# Altium project PCB_Project_bkres.PrjPcb
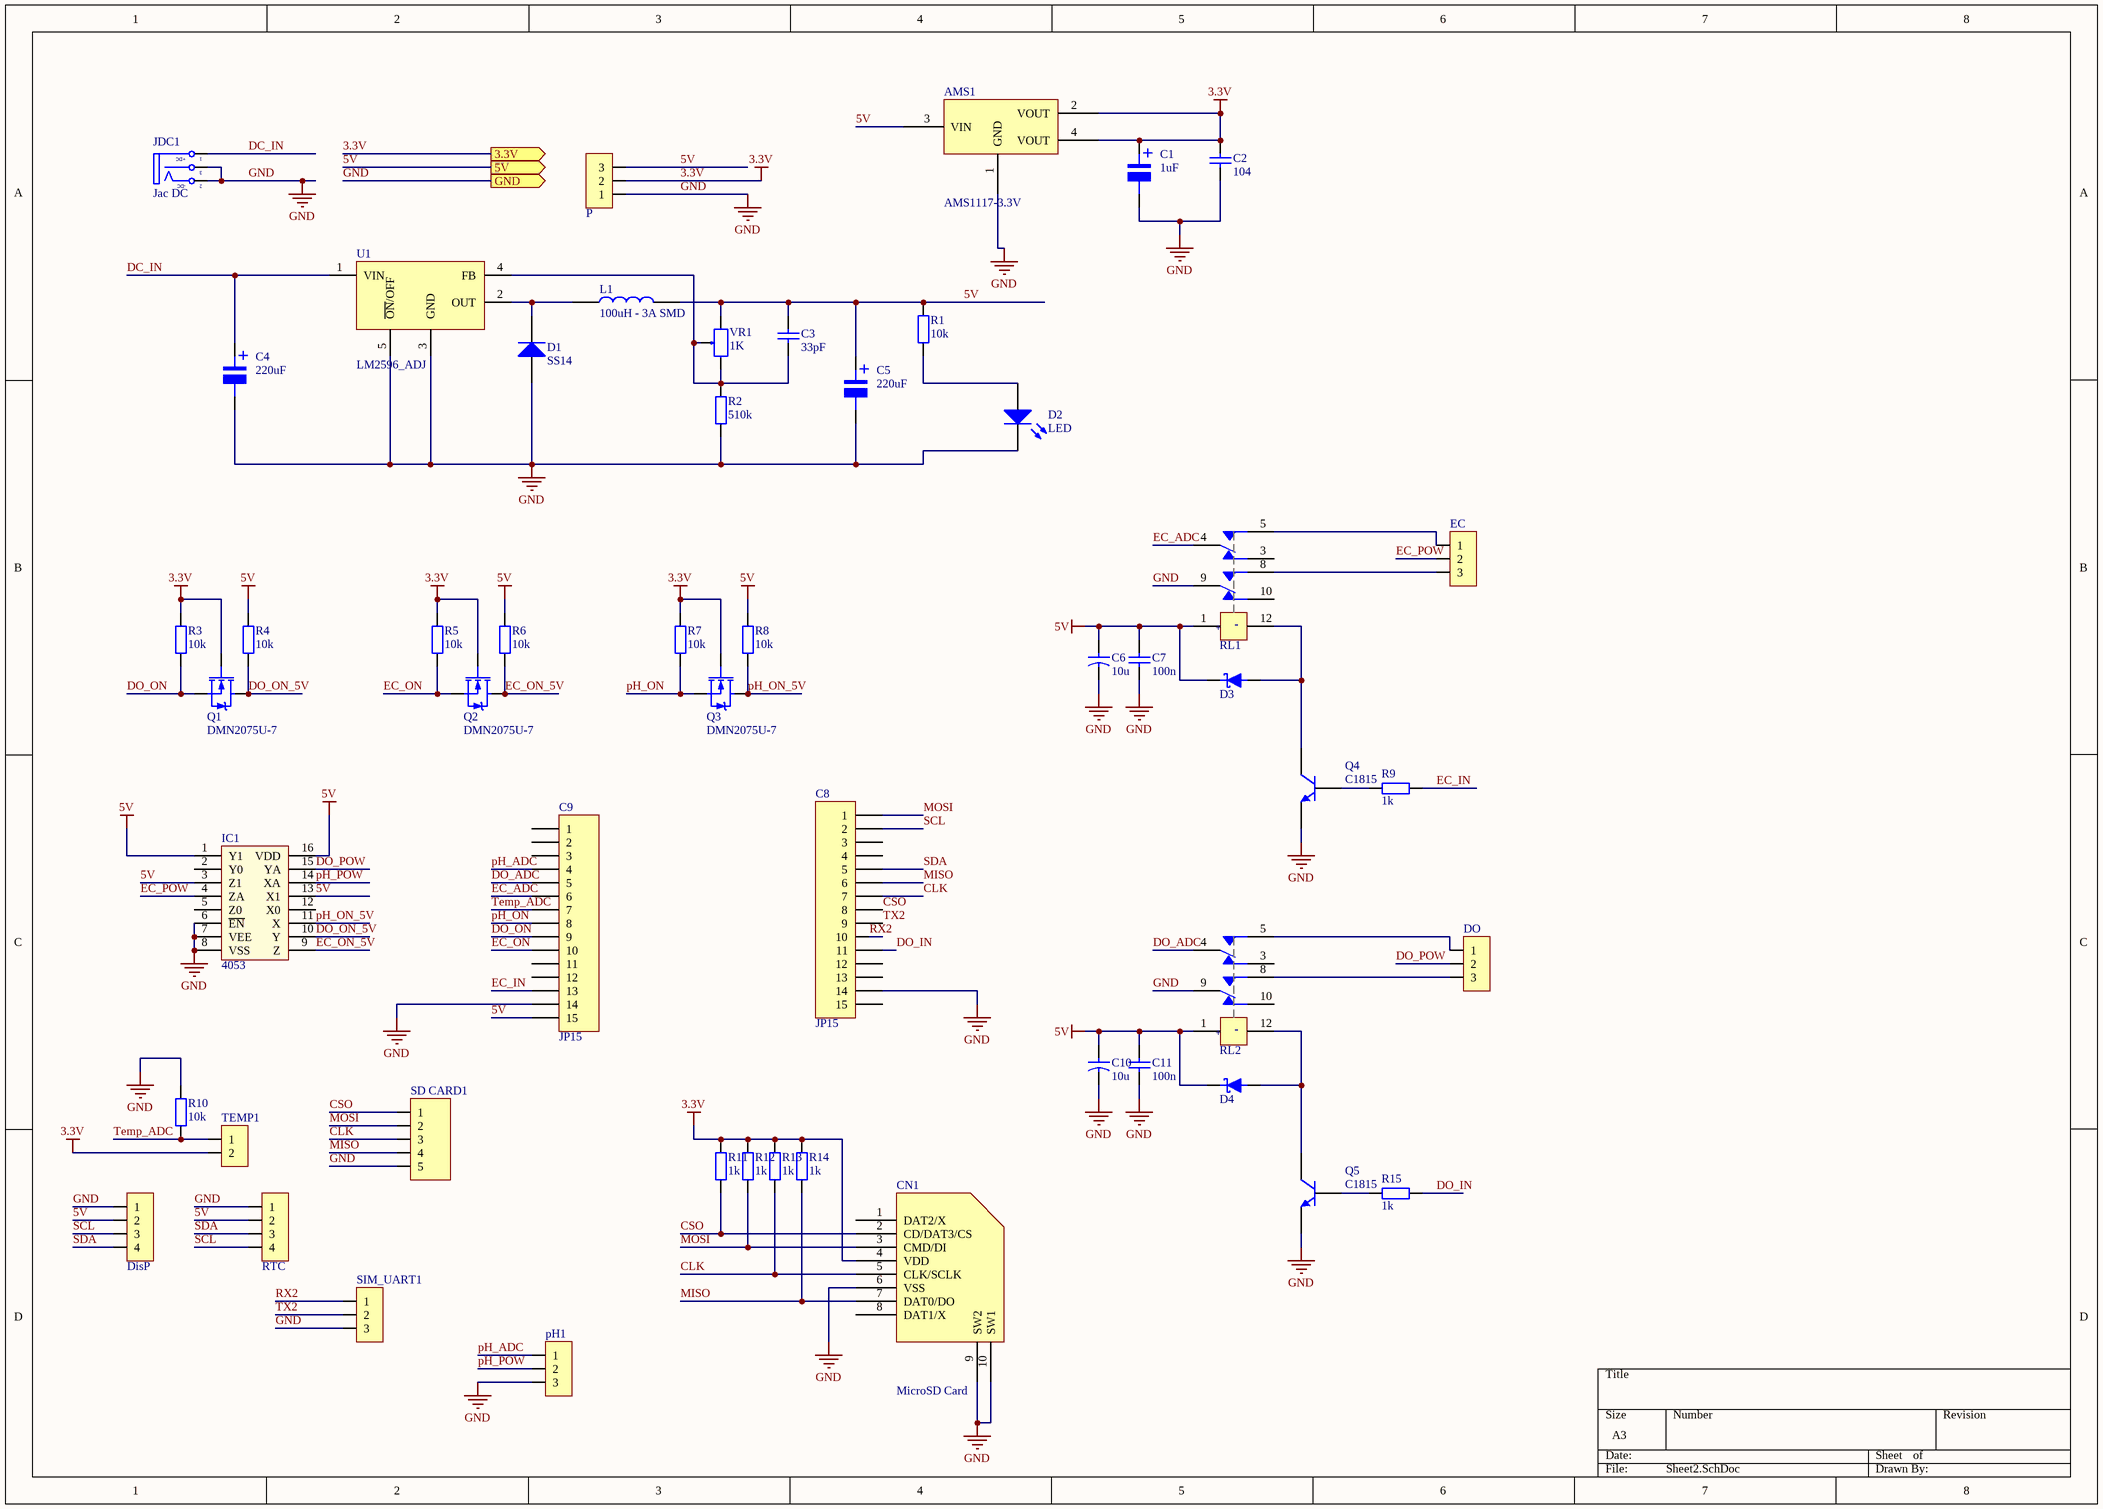
[diagram p0: Sheet2.SchDoc]
1 sheet, 53 parts. Net scope: flat (ports and power ports of the same name join across sheets).
Board file: PCB1.PcbDoc

## Sheet Sheet2.SchDoc
size A3; SheetNumber: 1; SheetTotal: 1

### Parts
AMS1  AMS1117-3.3V  [SOT223]
C1  1uF  [tu nhom 4 (B)]
C2  104  [tu 0805]
C3  33pF  [tu 0805]
C4  220uF  [tu nhom 6.3 (d)]
C5  220uF  [tu nhom 6.3 (d)]
C6  value 10u  [CT1206]  (hidden comment: C-P)
C7  value 100n  [CC0805L]  (hidden comment: C-N)
C8  JP15  [JP15-C1T]
C9  JP15  [JP15-C1T]
C10  value 10u  [CT1206]  (hidden comment: C-P)
C11  value 100n  [CC0805L]  (hidden comment: C-N)
CN1  MicroSD Card  [MicroSD Card]
D1  SS14  [DIODE SMA]
D2  LED  [LED-0805-Red]
D3  D Schottky  [DO-214AC]  (value not drawn)
D4  D Schottky  [DO-214AC]  (value not drawn)
IC1  4053  [SO16]
JDC1  Jac DC  [DC-IN]
JP1  DisP  [JP 1x4 CT]
JP2  EC  [JP 1x3 DT]
JP3  DO  [JP 1x3 DT]
JP4  RTC  [JP 1x4 CT]
L1  100uH - 3A SMD  [Cuon Cam 12x12x10]
P  SIM_UART  [JP 1x3 DT]  (value not drawn)
pH1  pH  [JP 1x3 DT]  (value not drawn)
Q1  DMN2075U-7  [SOT23]
Q2  DMN2075U-7  [SOT23]
Q3  DMN2075U-7  [SOT23]
Q4  C1815  [SOT-23]
Q5  C1815  [SOT-23]
R1  10k  [tro smd 0805]
R2  510k  [tro smd 0805]
R3  10k  [tro smd 0805]
R4  10k  [tro smd 0805]
R5  10k  [tro smd 0805]
R6  10k  [tro smd 0805]
R7  10k  [tro smd 0805]
R8  10k  [tro smd 0805]
R9  1k  [tro smd 0805]
R10  10k  [tro smd 0805]
R11  1k  [tro smd 0805]
R12  1k  [tro smd 0805]
R13  1k  [tro smd 0805]
R14  1k  [tro smd 0805]
R15  1k  [tro smd 0805]
RL1  RL-G6S-2  [RL_G6S-2]  (value not drawn)
RL2  RL-G6S-2  [RL_G6S-2]  (value not drawn)
SD_CARD1  JP 1x5 2.54  [JP 1x5 DT]  (value not drawn)
SIM_UART1  SIM_UART  [JP 1x3 DT]  (value not drawn)
TEMP1  JP 1x2 2.54  [JP 1x2 DT]  (value not drawn)
U1  LM2596_ADJ  [TO263-5]
VR1  1K  [Bien Tro Vi Chinh Dung]

### Ports
3.3V (out), 5V (out), GND (out)

### Nets
3.3V: AMS1.2(VOUT) AMS1.4(VOUT) C1.1 C2.1 CN1.4(VDD) P.2 Q1.1(G) Q2.1(G) Q3.1(G) R3.2 R5.2 R7.2 R11.2 R12.2 R13.2 R14.2 TEMP1.2 ; port 3.3V
5V: AMS1.3(VIN) C3.1 C5.1 C6.1 C7.2 C9.15 C10.1 C11.2 D3.2(K) D4.2(K) IC1.1(Y1) IC1.3(Z1) IC1.13(X1) IC1.16(VDD) JP1.2 JP4.2 L1.2 P.3 R1.2 R4.2 R6.2 R8.2 RL1.1 RL2.1 VR1.3 ; port 5V
GND: AMS1.1(GND) C1.2 C2.2 C4.2 C5.2 C6.2 C7.1 C8.14 C9.14 C10.2 C11.1 CN1.6(VSS) CN1.9(SW2) CN1.10(SW1) D1.1(A) D2.2(K) IC1.6(~{EN}) IC1.7(VEE) IC1.8(VSS) JDC1.2(TN) JDC1.3(S) JP1.1 JP4.1 P.1 pH1.3 Q4.1(E) Q5.1(E) R2.1 R10.2 RL1.9 RL2.9 SD_CARD1.5 SIM_UART1.3 U1.3(GND) U1.5(~{ON}/OFF) ; port GND
CLK: C8.7 CN1.5(CLK/SCLK) R13.1 SD_CARD1.3
CSO: C8.8 CN1.2(CD/DAT3/CS) R11.1 SD_CARD1.1
DC_IN: C4.1 JDC1.1(T) U1.1(VIN)
DO_ADC: C9.5 RL2.4
DO_IN: C8.11 R15.2
DO_ON: C9.9 Q1.2(S) R3.1
DO_ON_5V: IC1.10(Y) Q1.3(D) R4.1
DO_POW: IC1.15(YA) JP3.2
EC_ADC: C9.6 RL1.4
EC_IN: C9.13 R9.2
EC_ON: C9.10 Q2.2(S) R5.1
EC_ON_5V: IC1.9(Z) Q2.3(D) R6.1
EC_POW: IC1.4(ZA) JP2.2
MISO: C8.6 CN1.7(DAT0/DO) R14.1 SD_CARD1.4
MOSI: C8.1 CN1.3(CMD/DI) R12.1 SD_CARD1.2
pH_ADC: C9.4 pH1.1
pH_ON: C9.8 Q3.2(S) R7.1
pH_ON_5V: IC1.11(X) Q3.3(D) R8.1
pH_POW: IC1.14(XA) pH1.2
RX2: C8.10 SIM_UART1.1
SCL: C8.2 JP1.3 JP4.4
SDA: C8.5 JP1.4 JP4.3
Temp_ADC: C9.7 R10.1 TEMP1.1
TX2: C8.9 SIM_UART1.2
NetC3_2: C3.2 R2.2 U1.4(FB) VR1.1 VR1.2
NetD1_2: D1.2(K) L1.1 U1.2(OUT)
NetD2_1: D2.1(A) R1.1
NetD3_1: D3.1(A) Q4.2(C) RL1.12
NetD4_1: D4.1(A) Q5.2(C) RL2.12
NetJP2_1: JP2.1 RL1.5
NetJP2_3: JP2.3 RL1.8
NetJP3_1: JP3.1 RL2.5
NetJP3_3: JP3.3 RL2.8
NetQ4_3: Q4.3(B) R9.1
NetQ5_3: Q5.3(B) R15.1

Not connected (* = marked no-connect by the designer): C8 3 4 12 13 15; C9 1 2 3 11 12; CN1 1(DAT2/X) 8(DAT1/X); IC1 2(Y0) 5(Z0) 12(X0); RL1 3 10; RL2 3 10

### Notes on the sheet
- (in symbol DCIN) +DC; -DC
- (in symbol RL-G6S-2) +; -
- (in symbol Tu Nhom 1uF 50V) +
- (in symbol Tu Nhom 220uF 16V) +

### Library data of the parts
AMS1 = AMS1117 SMD: Dán; Value: AMS1117-3.3V SOT223; Don_Vi: Con; Ma_Hang: MH000596; Ghi_Chu: *; Kieu_Chan: *; Chung_Loai: Dán
C1 = Tu Nhom 1uF 50V: Dán; Don_Vi: Con; So_Chan: 2; Ten_Linh_Kien: Tụ Nhôm 1uF 50V 4x5.4MM; Ma_Hang: MH007467; Chung_Loai: Dán; Kieu_Chan: *
C2 = Tu 0805 104 50V 10%: Dán; Don_Vi: Con; So_Chan: 2; Ten_Linh_Kien: Tụ 0805 104-100nF 10% 50V; Ma_Hang: MH004551; Chung_Loai: Dán; Kieu_Chan: *
C3 = Tu 0805 33pF 50V 10%: Dán; Don_Vi: Con; So_Chan: 2; Ten_Linh_Kien: Tụ 0805 33p 10% 50V; Ma_Hang: MH004563; Chung_Loai: Dán; Kieu_Chan: *
C4 C5 = Tu Nhom 220uF 16V: Dán; Don_Vi: Con; So_Chan: 2; Ten_Linh_Kien: Tụ Nhôm 220uF 16V 6.3x7.7MM; Ma_Hang: MH002227; Chung_Loai: Dán; Kieu_Chan: *
C6 C10 = C-P: Polar Capacitor
C7 C11 = C-N: Non-Polar Capacitor
C8 C9 = JP15: WR-PHD 2.54 mm Angled Socket Header; Manufacturer: W¨¹rth Elektronik eiSos GmbH; partNo: 613015143121; ComponentLink1 Description: Manufacturer; ComponentLink2 Description: Datasheet; NoPins: 15; Created Date: 29 March 2013; ComponentLink1URL: http://www.we-online.com; ComponentLink2URL: http://katalog.we-online.de/em/datasheet/6130xx143121.pdf; Created by: Karrer Zheng
D1 = Diode SS14 ( 1N5819): Dán; Ma_Hang: MH002211; Don_Vi: Con; Ten_Linh_Kien: Diode SS14 DO214 Schottky 1A 40V ( 1N5819 DO214); Chung_Loai: Dán; Ghi_Chu: *; Kieu_Chan: *
D2 = LED: Typical INFRARED GaAs LED; Published: 8-Jun-2000; LatestRevisionDate: 08-Jul-2005; LatestRevisionNote: Mech Layer 1 removed.; PackageReference: LED-0; Publisher: Altium Limited
D3 D4 = D Schottky: Schottky Diode
IC1 = 4053: Dual 4-channel analogue  multiplexer/demultiplexer; Value: CD4053; Value: DIP16
JDC1 = DCIN: Jac DC input; Value: Jac DC
JP1 JP4 = JP 1x4 2.54 Cai Thang: Cắm; Ten_Linh_Kien: Jump Đơn Cái 2.54MM 1x20P Thẳng; Don_Vi: Con; Ma_Hang: MH004006; Ghi_Chu: *; Kieu_Chan: *; Chung_Loai: Cắm
JP2 JP3 P pH1 SIM_UART1 = JP 1x3 2.54 Duc Thang: Cắm; Ten_Linh_Kien: Jump Đơn Đực 2.54MM 1x40P Thẳng 11MM; Don_Vi: Con; Ma_Hang: MH000903; Ghi_Chu: *; Kieu_Chan: *; Chung_Loai: Cắm
L1 = CUON CAM 100uH SMD: Dán; Don_Vi: Con; Ma_Hang: MH003999; Ten_Linh_Kien: Cuộn Cảm 100uH 7x7x4MM CD74; Ma_Hang: *; Kieu_Chan: *; Chung_Loai: Dán
Q1-Q3 = DMN2075U-7: MOSFET N-CH 20V 4.2A SOT23; Published: 8-Jun-2000; LatestRevisionDate: 17-Jul-2002; LatestRevisionNote: Re-released for DXP Platform.; PackageVersion: 1995/1996; PackageReference: E3; Publisher: Altium Limited
Q4 Q5 = QC1815: NPN G, 150mA, 150MHz; pin to pad: 1>2 2>3 3>1
R1 R10 = Tro 0805 1% 10k: Dán; Don_Vi: Con; So_Chan: 2; Ten_Linh_Kien: Trở 0805 1% 10k; Ma_Hang: MH005473; Chung_Loai: Dán; Kieu_Chan: *
R2 = Tro 0805 1% 510k: Dán; Don_Vi: Con; So_Chan: 2; Ten_Linh_Kien: Trở 0805 1% 510k; Ma_Hang: MH005486; Chung_Loai: Dán; Kieu_Chan: *
R3-R9 R11-R15 = Tro 0805 1% 1k: Dán; Don_Vi: Con; So_Chan: 2; Ten_Linh_Kien: Trở 0805 1% 1k; Ma_Hang: MH005468; Chung_Loai: Dán; Kieu_Chan: *
SD_CARD1 = JP 1x5 2.54 Duc Thang: Cắm; Ten_Linh_Kien: Jump Đơn Đực 2.54MM 1x40P Thẳng 11MM; Don_Vi: Con; Ma_Hang: MH000903; Ghi_Chu: *; Kieu_Chan: *; Chung_Loai: Cắm
TEMP1 = JP 1x2 2.54 Duc Thang: Cắm; Ten_Linh_Kien: Jump Đơn Đực 2.54MM 1x40P Thẳng 11MM; Don_Vi: Con; Ma_Hang: MH000903; Ghi_Chu: *; Kieu_Chan: *; Chung_Loai: Cắm
VR1 = Bien Tro Tinh Chinh 1K Dung: Cắm; Don_Vi: Con; Ten_Linh_Kien: Biến Trở VR 102-1K 3296W; Ma_Hang: MH003234; Kieu_Chan: *; Chung_Loai: Cắm